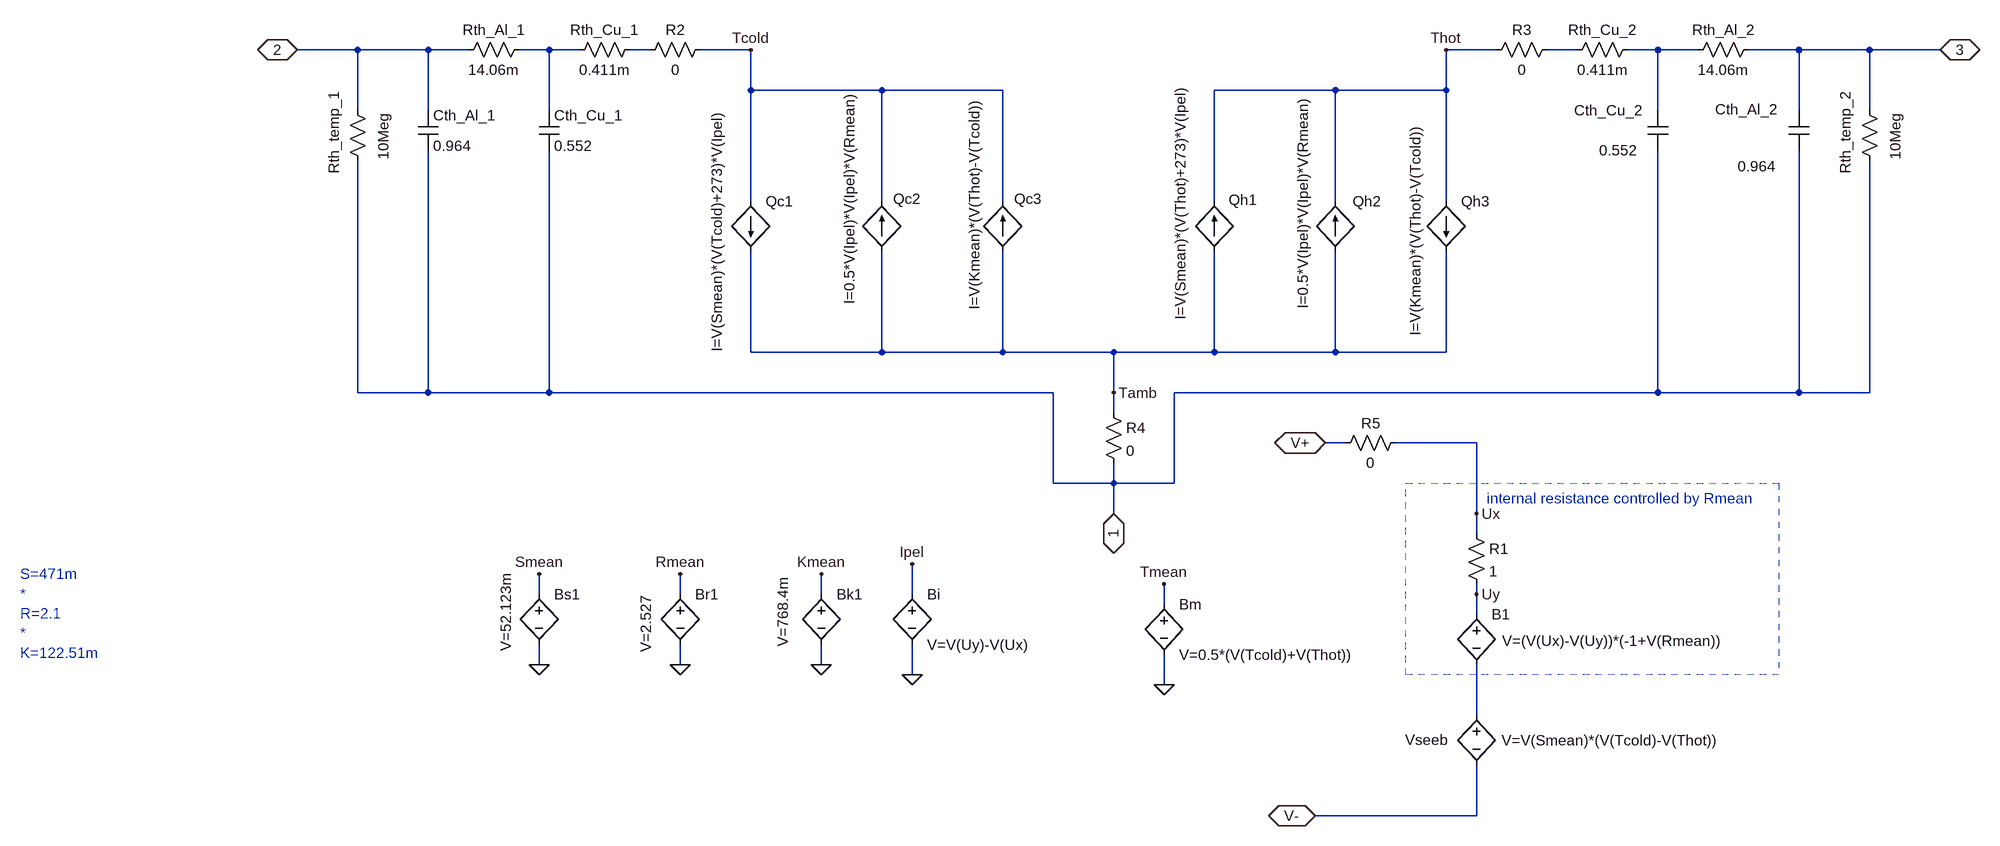
[diagram p0: schematic TEM-12706.asc]
TEM-12706.asc, the LTspice schematic file:
Version 4
SHEET 1 1184 804
WIRE -1840 -544 -1936 -544
WIRE -1728 -544 -1840 -544
WIRE -1664 -544 -1728 -544
WIRE -1536 -544 -1584 -544
WIRE -1488 -544 -1536 -544
WIRE -1376 -544 -1408 -544
WIRE -1216 -544 -1296 -544
WIRE -32 -544 -112 -544
WIRE 96 -544 48 -544
WIRE 224 -544 176 -544
WIRE 288 -544 224 -544
WIRE 448 -544 368 -544
WIRE 560 -544 448 -544
WIRE 672 -544 560 -544
WIRE -1216 -480 -1216 -544
WIRE -1008 -480 -1216 -480
WIRE -816 -480 -1008 -480
WIRE -288 -480 -480 -480
WIRE -112 -480 -112 -544
WIRE -112 -480 -288 -480
WIRE -1840 -448 -1840 -544
WIRE -1728 -448 -1728 -544
WIRE -1536 -448 -1536 -544
WIRE 224 -448 224 -544
WIRE 448 -448 448 -544
WIRE 560 -448 560 -544
WIRE -1216 -304 -1216 -480
WIRE -1008 -304 -1008 -480
WIRE -816 -304 -816 -480
WIRE -480 -304 -480 -480
WIRE -288 -304 -288 -480
WIRE -112 -304 -112 -480
WIRE -1216 -64 -1216 -224
WIRE -1008 -64 -1008 -224
WIRE -1008 -64 -1216 -64
WIRE -816 -64 -816 -224
WIRE -816 -64 -1008 -64
WIRE -640 -64 -816 -64
WIRE -480 -64 -480 -224
WIRE -480 -64 -640 -64
WIRE -288 -64 -288 -224
WIRE -288 -64 -480 -64
WIRE -112 -64 -112 -224
WIRE -112 -64 -288 -64
WIRE -1840 0 -1840 -368
WIRE -1728 0 -1728 -384
WIRE -1728 0 -1840 0
WIRE -1536 0 -1536 -384
WIRE -1536 0 -1728 0
WIRE -736 0 -1536 0
WIRE -640 0 -640 -64
WIRE 224 0 224 -384
WIRE 224 0 -544 0
WIRE 448 0 448 -384
WIRE 448 0 224 0
WIRE 560 0 560 -368
WIRE 560 0 448 0
WIRE -640 32 -640 0
WIRE -272 80 -304 80
WIRE -64 80 -192 80
WIRE -736 144 -736 0
WIRE -640 144 -640 112
WIRE -640 144 -736 144
WIRE -544 144 -544 0
WIRE -544 144 -640 144
WIRE -640 192 -640 144
WIRE -64 192 -64 80
WIRE -64 224 -64 192
WIRE -1552 320 -1552 288
WIRE -1328 320 -1328 288
WIRE -1104 320 -1104 288
WIRE -960 320 -960 272
WIRE -64 320 -64 304
WIRE -560 336 -560 304
WIRE -64 352 -64 320
WIRE -1552 432 -1552 400
WIRE -1328 432 -1328 400
WIRE -1104 432 -1104 400
WIRE -960 448 -960 400
WIRE -560 464 -560 416
WIRE -64 512 -64 432
WIRE -64 672 -64 592
WIRE -64 672 -320 672
FLAG -560 464 0
FLAG -560 304 Tmean
FLAG -64 192 Ux
FLAG -64 320 Uy
FLAG -960 448 0
FLAG -960 272 Ipel
FLAG -1552 432 0
FLAG -1328 432 0
FLAG -1104 432 0
FLAG -1552 288 Smean
FLAG -1328 288 Rmean
FLAG -1104 288 Kmean
FLAG 672 -544 3
IOPIN 672 -544 BiDir
FLAG -640 192 1
IOPIN -640 192 BiDir
FLAG -1936 -544 2
IOPIN -1936 -544 BiDir
FLAG -304 80 V+
IOPIN -304 80 BiDir
FLAG -320 672 V-
IOPIN -320 672 BiDir
FLAG -1216 -544 Tcold
FLAG -112 -544 Thot
FLAG -640 0 Tamb
SYMBOL bi -1216 -304 R0
WINDOW 3 -54 240 VLeft 2
SYMATTR Value I=V(Smean)*(V(Tcold)+273)*V(Ipel)
SYMATTR InstName Qc1
SYMBOL bi -480 -224 R180
WINDOW 0 -68 82 Left 2
WINDOW 3 54 262 VLeft 2
SYMATTR InstName Qh1
SYMATTR Value I=V(Smean)*(V(Thot)+273)*V(Ipel)
SYMBOL bi -1008 -224 R180
WINDOW 0 -62 84 Left 2
WINDOW 3 51 250 VLeft 2
SYMATTR InstName Qc2
SYMATTR Value I=0.5*V(Ipel)*V(Ipel)*V(Rmean)
SYMBOL bi -288 -224 R180
WINDOW 0 -73 80 Left 2
WINDOW 3 51 243 VLeft 2
SYMATTR InstName Qh2
SYMATTR Value I=0.5*V(Ipel)*V(Ipel)*V(Rmean)
SYMBOL bv -560 320 R0
SYMATTR InstName Bm
SYMATTR Value V=0.5*(V(Tcold)+V(Thot))
SYMBOL bi -816 -224 R180
WINDOW 0 -62 84 Left 2
WINDOW 3 45 243 VLeft 2
SYMATTR InstName Qc3
SYMATTR Value I=V(Kmean)*(V(Thot)-V(Tcold))
SYMBOL bi -112 -304 R0
WINDOW 3 -49 214 VLeft 2
SYMATTR Value I=V(Kmean)*(V(Thot)-V(Tcold))
SYMATTR InstName Qh3
SYMBOL bv -64 496 R0
WINDOW 3 40 56 Left 2
WINDOW 0 -113 55 Left 2
SYMATTR Value V=V(Smean)*(V(Tcold)-V(Thot))
SYMATTR InstName Vseeb
SYMBOL res -80 208 R0
SYMATTR InstName R1
SYMATTR Value 1
SYMBOL bv -64 336 R0
WINDOW 3 41 58 Left 2
SYMATTR Value V=(V(Ux)-V(Uy))*(-1+V(Rmean))
SYMATTR InstName B1
SYMBOL bv -960 304 R0
SYMATTR InstName Bi
SYMATTR Value V=V(Uy)-V(Ux)
SYMBOL bv -1552 304 R0
WINDOW 3 -53 45 VCenter 2
SYMATTR Value V=52.123m
SYMATTR InstName Bs1
SYMBOL bv -1328 304 R0
WINDOW 3 -54 18 VRight 2
SYMATTR Value V=2.527
SYMATTR InstName Br1
SYMBOL bv -1104 304 R0
WINDOW 3 -61 45 VCenter 2
SYMATTR Value V=768.4m
SYMATTR InstName Bk1
SYMBOL res -1280 -560 R90
WINDOW 0 0 56 VBottom 2
WINDOW 3 32 56 VTop 2
SYMATTR InstName R2
SYMATTR Value 0
SYMBOL res 64 -560 R90
WINDOW 0 0 56 VBottom 2
WINDOW 3 32 56 VTop 2
SYMATTR InstName R3
SYMATTR Value 0
SYMBOL res -656 16 R0
SYMATTR InstName R4
SYMATTR Value 0
SYMBOL res -1392 -560 R90
WINDOW 0 0 56 VBottom 2
WINDOW 3 32 56 VTop 2
SYMATTR InstName Rth_Cu_1
SYMATTR Value 0.411m
SYMBOL cap -1552 -448 R0
SYMATTR InstName Cth_Cu_1
SYMATTR Value 0.552
SYMBOL res -1568 -560 R90
WINDOW 0 0 56 VBottom 2
WINDOW 3 32 56 VTop 2
SYMATTR InstName Rth_Al_1
SYMATTR Value 14.06m
SYMBOL cap -1744 -448 R0
SYMATTR InstName Cth_Al_1
SYMATTR Value 0.964
SYMBOL res -1856 -464 R0
WINDOW 0 -22 117 VLeft 2
WINDOW 3 57 95 VLeft 2
SYMATTR InstName Rth_temp_1
SYMATTR Value 10Meg
SYMBOL res 192 -560 R90
WINDOW 0 0 56 VBottom 2
WINDOW 3 32 56 VTop 2
SYMATTR InstName Rth_Cu_2
SYMATTR Value 0.411m
SYMBOL cap 208 -448 R0
WINDOW 0 -117 0 Left 2
WINDOW 3 -77 63 Left 2
SYMATTR InstName Cth_Cu_2
SYMATTR Value 0.552
SYMBOL res 384 -560 R90
WINDOW 0 0 56 VBottom 2
WINDOW 3 32 56 VTop 2
SYMATTR InstName Rth_Al_2
SYMATTR Value 14.06m
SYMBOL cap 432 -448 R0
WINDOW 0 -117 -2 Left 2
WINDOW 3 -81 89 Left 2
SYMATTR InstName Cth_Al_2
SYMATTR Value 0.964
SYMBOL res 544 -464 R0
WINDOW 0 -22 117 VLeft 2
WINDOW 3 57 95 VLeft 2
SYMATTR InstName Rth_temp_2
SYMATTR Value 10Meg
SYMBOL res -176 64 R90
WINDOW 0 0 56 VBottom 2
WINDOW 3 32 56 VTop 2
SYMATTR InstName R5
SYMATTR Value 0
TEXT -48 168 Left 2 ;internal resistance controlled by Rmean
TEXT -2376 288 Left 2 ;S=471m\n*\nR=2.1\n*\nK=122.51m
RECTANGLE Normal 416 448 -176 144 2

The netlist it stands for:
* TEM-12706.asc
B§Qc1 Tcold Tamb I=V(Smean)*(V(Tcold)+273)*V(Ipel)
B§Qh1 Tamb Thot I=V(Smean)*(V(Thot)+273)*V(Ipel)
B§Qc2 Tamb Tcold I=0.5*V(Ipel)*V(Ipel)*V(Rmean)
B§Qh2 Tamb Thot I=0.5*V(Ipel)*V(Ipel)*V(Rmean)
Bm Tmean 0 V=0.5*(V(Tcold)+V(Thot))
B§Qc3 Tamb Tcold I=V(Kmean)*(V(Thot)-V(Tcold))
B§Qh3 Thot Tamb I=V(Kmean)*(V(Thot)-V(Tcold))
B§Vseeb N005 V- V=V(Smean)*(V(Tcold)-V(Thot))
R1 Ux Uy 1
B1 Uy N005 V=(V(Ux)-V(Uy))*(-1+V(Rmean))
Bi Ipel 0 V=V(Uy)-V(Ux)
Bs1 Smean 0 V=52.123m
Br1 Rmean 0 V=2.527
Bk1 Kmean 0 V=768.4m
R2 Tcold N002 0
R3 N003 Thot 0
R4 Tamb 1 0
Rth_Cu_1 N002 N001 0.411m
Cth_Cu_1 N001 1 0.552
Rth_Al_1 N001 2 14.06m
Cth_Al_1 2 1 0.964
Rth_temp_1 2 1 10Meg
Rth_Cu_2 N004 N003 0.411m
Cth_Cu_2 N004 1 0.552
Rth_Al_2 3 N004 14.06m
Cth_Al_2 3 1 0.964
Rth_temp_2 3 1 10Meg
R5 Ux V+ 0
* internal resistance controlled by Rmean
* S=471m
* *
* R=2.1
* *
* K=122.51m
.backanno
.end